# EasyEDA schematic SCH-mfd-menu-panel.json
TITLE: CJ4 MFD Menu panel; REV: 1.0; Date: 2021-06-11; Sheet: 1/1; Drawn By: Tuomas Kuosmanen; Company: Your Company
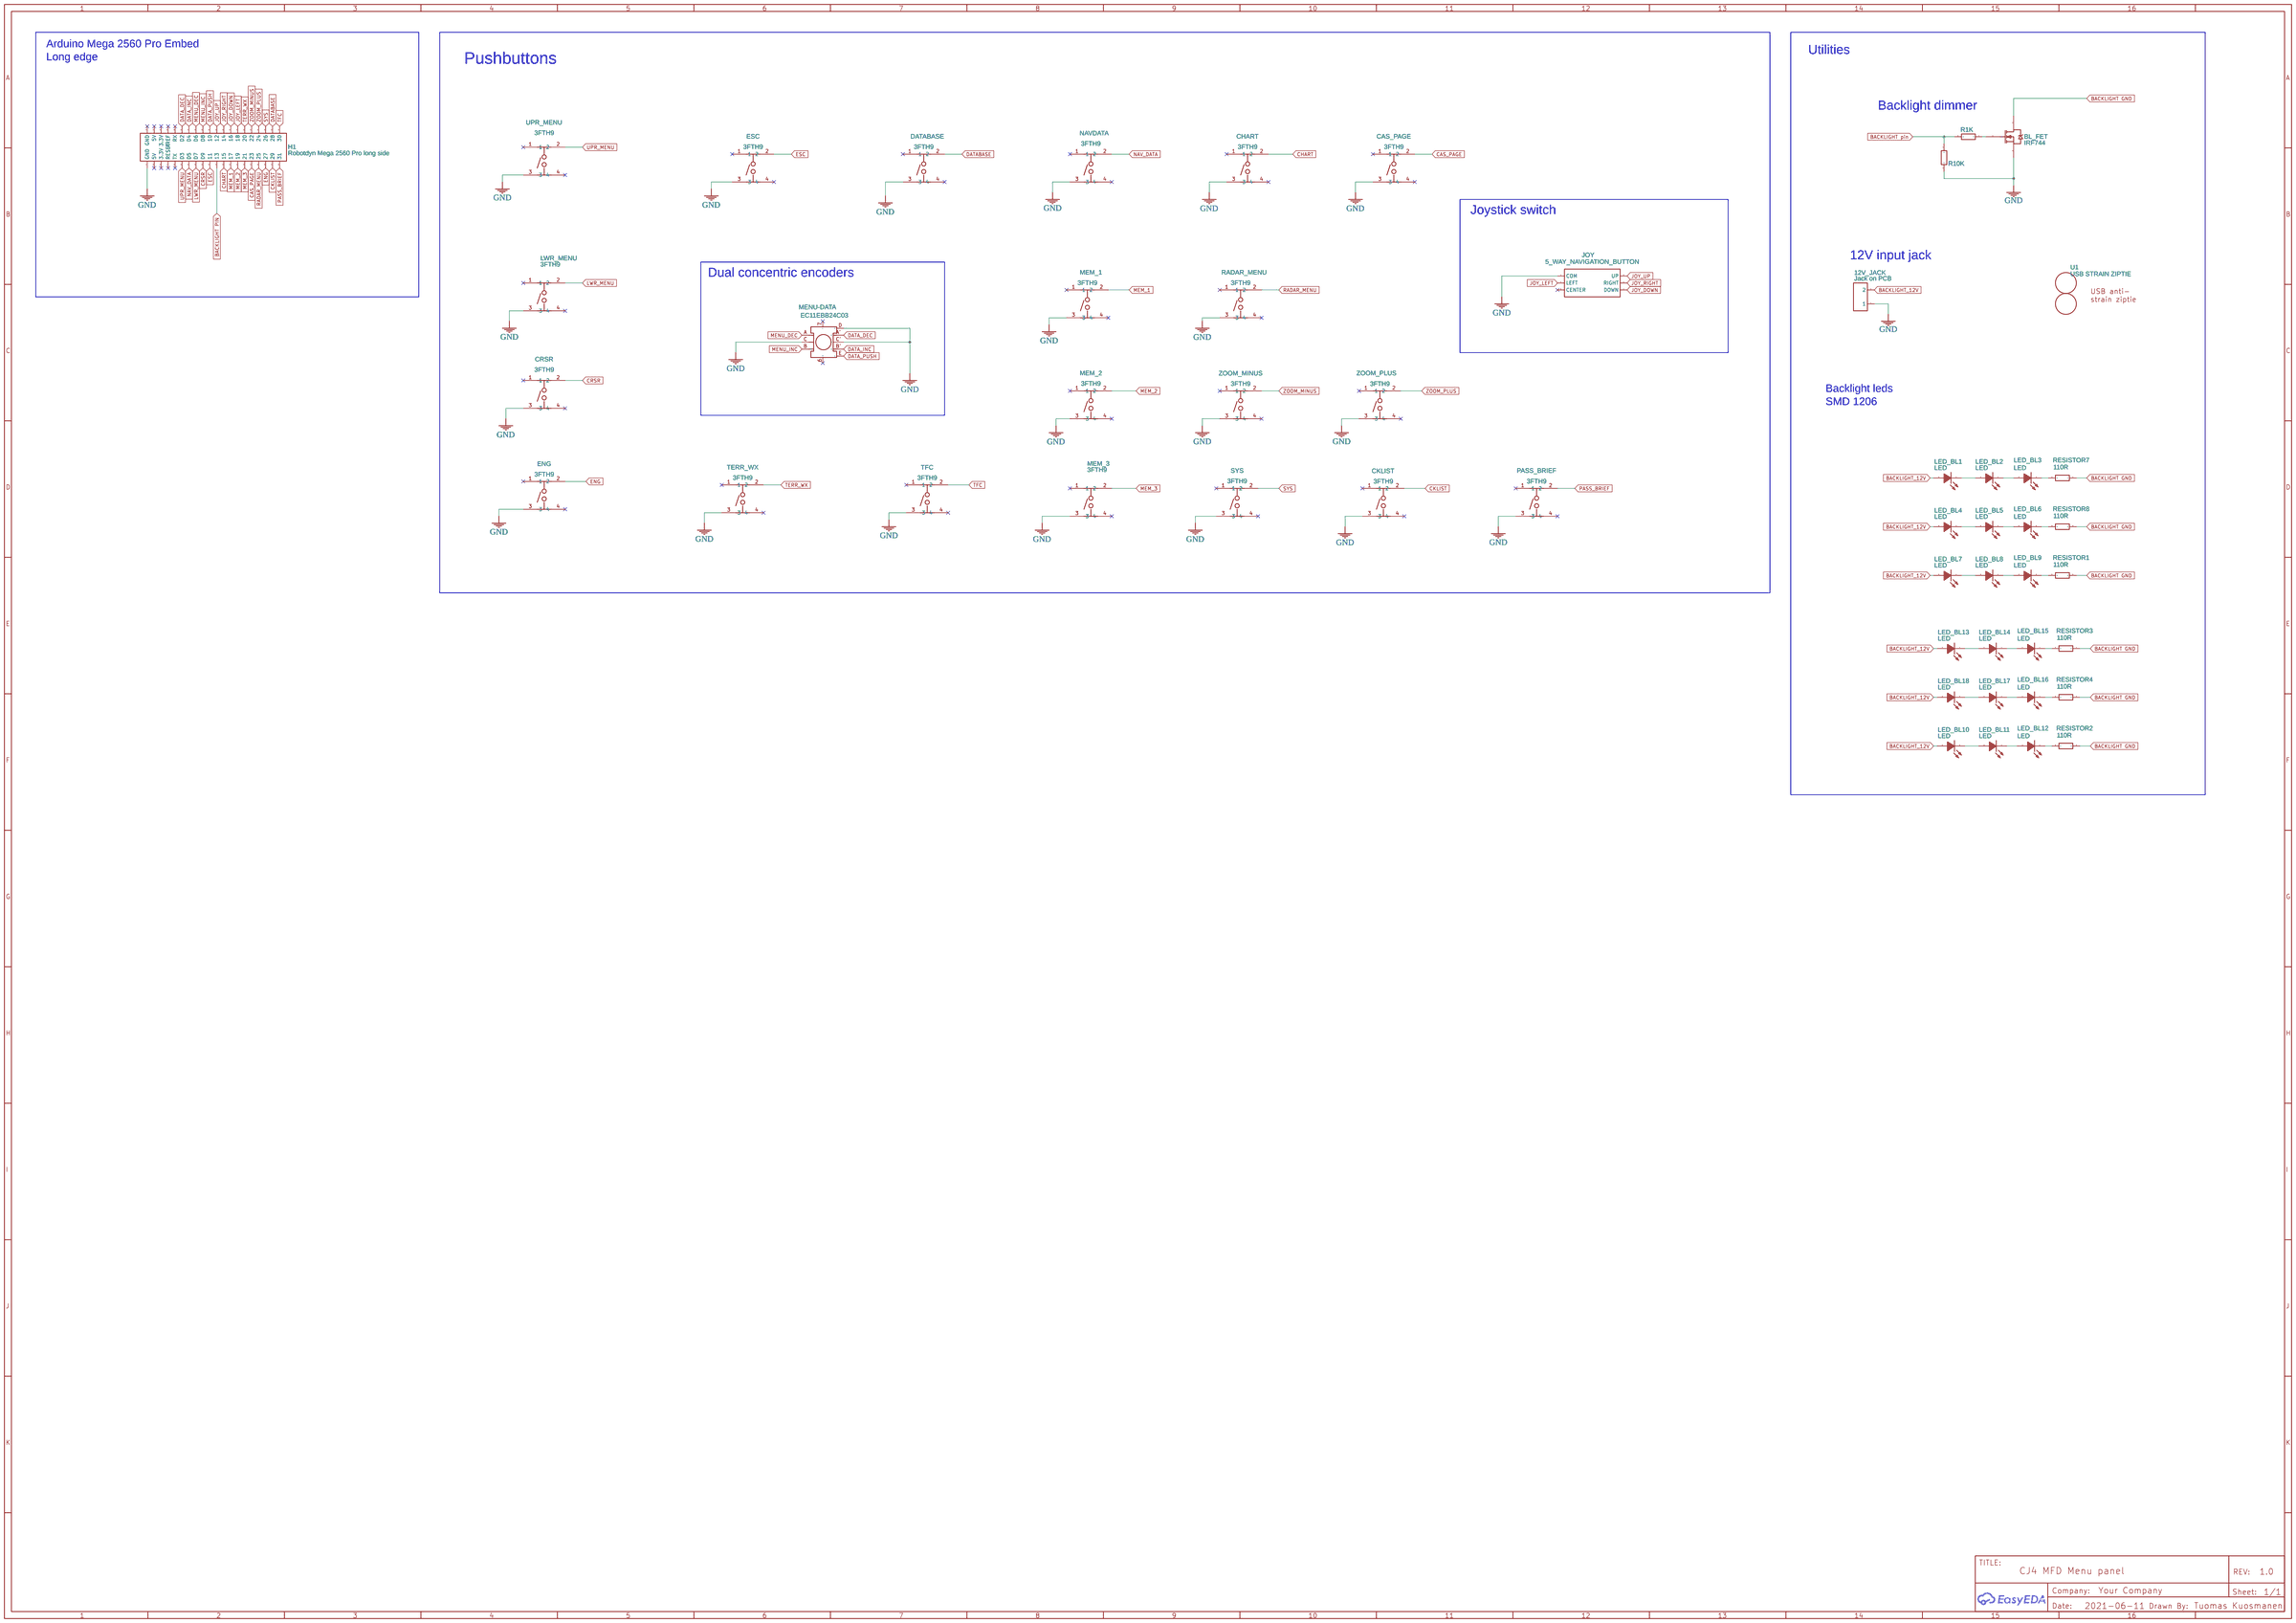
[diagram p0: schematic sheet]

## Parts
12V_JACK  Jack on PCB  [JACK ON PCB]
BL_FET  IRF744  [TO-220AB]
CAS_PAGE  3FTH9  [MULTIMEC 3FTH9 - NO LED]
CHART  3FTH9  [MULTIMEC 3FTH9 - NO LED]
CKLIST  3FTH9  [MULTIMEC 3FTH9 - NO LED]
CRSR  3FTH9  [MULTIMEC 3FTH9 - NO LED]
DATABASE  3FTH9  [MULTIMEC 3FTH9 - NO LED]
ENG  3FTH9  [MULTIMEC 3FTH9 - NO LED]
ESC  3FTH9  [MULTIMEC 3FTH9 - NO LED]
H1  Robotdyn Mega 2560 Pro long side  [HDR-TH_40P-P2.54-V-M-R2-C20-S2.54]
JOY  5_WAY_NAVIGATION_BUTTON  [5_WAY_NAVIGATION_BUTTON]
LED_BL1  LED  [LED1206-RD]
LED_BL2  LED  [LED1206-RD]
LED_BL3  LED  [LED1206-RD]
LED_BL4  LED  [LED1206-RD]
LED_BL5  LED  [LED1206-RD]
LED_BL6  LED  [LED1206-RD]
LED_BL7  LED  [LED1206-RD]
LED_BL8  LED  [LED1206-RD]
LED_BL9  LED  [LED1206-RD]
LED_BL10  LED  [LED1206-RD]
LED_BL11  LED  [LED1206-RD]
LED_BL12  LED  [LED1206-RD]
LED_BL13  LED  [LED1206-RD]
LED_BL14  LED  [LED1206-RD]
LED_BL15  LED  [LED1206-RD]
LED_BL16  LED  [LED1206-RD]
LED_BL17  LED  [LED1206-RD]
LED_BL18  LED  [LED1206-RD]
LWR_MENU  3FTH9  [MULTIMEC 3FTH9 - NO LED]
MEM_1  3FTH9  [MULTIMEC 3FTH9 - NO LED]
MEM_2  3FTH9  [MULTIMEC 3FTH9 - NO LED]
MEM_3  3FTH9  [MULTIMEC 3FTH9 - NO LED]
MENU-DATA  EC11EBB24C03  [SW-TH_EC11EBB24C03]
NAVDATA  3FTH9  [MULTIMEC 3FTH9 - NO LED]
PASS_BRIEF  3FTH9  [MULTIMEC 3FTH9 - NO LED]
PROTECT_BL1  R1K  [R1206]
R_ANN5  R10K  [R1206]
RADAR_MENU  3FTH9  [MULTIMEC 3FTH9 - NO LED]
RESISTOR1  110R  [R1206]
RESISTOR2  110R  [R1206]
RESISTOR3  110R  [R1206]
RESISTOR4  110R  [R1206]
RESISTOR7  110R  [R1206]
RESISTOR8  110R  [R1206]
SYS  3FTH9  [MULTIMEC 3FTH9 - NO LED]
TERR_WX  3FTH9  [MULTIMEC 3FTH9 - NO LED]
TFC  3FTH9  [MULTIMEC 3FTH9 - NO LED]
U1  USB STRAIN ZIPTIE  [USB STRAIN ZIPTIE]
UPR_MENU  3FTH9  [MULTIMEC 3FTH9 - NO LED]
ZOOM_MINUS  3FTH9  [MULTIMEC 3FTH9 - NO LED]
ZOOM_PLUS  3FTH9  [MULTIMEC 3FTH9 - NO LED]

## Library data of the parts
12V_JACK = J-Header-Male-2.54_1x2: Manufacturer: TE Connectivity; image: //image.lceda.cn/szlcsc/C86471.jpg; link: //image.lceda.cn/szlcsc/C86471.jpg; Package Display: No
BL_FET = IRF744: HEXFET N-Channel Power MOSFET
CAS_PAGE CHART CKLIST CRSR DATABASE ENG ESC LWR_MENU MEM_1-MEM_3 NAVDATA PASS_BRIEF RADAR_MENU SYS TERR_WX TFC UPR_MENU ZOOM_MINUS ZOOM_PLUS = 3FTH9: Manufacturer: MEC Switches; Supplier: Digi-Key; Supplier Part: 679-3730-5-ND; link: https://www.digikey.dk/product-detail/da/mec-switches/3FTH9/679-3730-5-ND/4376513; Contributor: Goose83
H1 = Header-Male-2.54_2x20: Supplier: LCSC; Manufacturer: ReliaPro; Supplier Part: C50980; JLCPCB Part Class: Extended Part
JOY = 5_WAY_NAVIGATION_BUTTON: Manufacturer Part: New SchematicLib; Contributor: lukasztolak
LED_BL1-LED_BL18 = HQ17-2102UYOC: Supplier: LCSC; Manufacturer: HARVATEK; Contributor: LCSC; Supplier Part: C154481; JLCPCB Part Class: Extended Part
MENU-DATA = EC11EBB24C03: Supplier: LCSC; Supplier Part: C470790; Manufacturer: ALPS Electric; Contributor: LCSC
PROTECT_BL1 R_ANN5 RESISTOR1-RESISTOR4 RESISTOR7 RESISTOR8 = 1206W4J0331T5E: Supplier: LCSC; Manufacturer: UniOhm; Supplier Part: C25374
U1 = USB STRAIN ZIPTIE: Contributor: tuomas.kuosmanen

## Nets
GND: 12V_JACK.1 BL_FET.3(S) CAS_PAGE.3 CHART.3 CKLIST.3 CRSR.3 DATABASE.3 ENG.3 ESC.3 H1.1(GND) JOY.1(COM) LWR_MENU.3 MEM_1.3 MEM_2.3 MEM_3.3 MENU-DATA.C MENU-DATA.C' MENU-DATA.D NAVDATA.3 PASS_BRIEF.3 R_ANN5.2 RADAR_MENU.3 SYS.3 TERR_WX.3 TFC.3 UPR_MENU.3 ZOOM_MINUS.3 ZOOM_PLUS.3
BACKLIGHT GND: BL_FET.2(D) RESISTOR1.1 RESISTOR2.1 RESISTOR3.1 RESISTOR4.1 RESISTOR7.1 RESISTOR8.1
BACKLIGHT PIN: H1.21(13)
BACKLIGHT pin: PROTECT_BL1.2 R_ANN5.1
BACKLIGHT_12V: 12V_JACK.2 LED_BL1.2(A) LED_BL4.2(A) LED_BL7.2(A) LED_BL10.2(A) LED_BL13.2(A) LED_BL18.2(A)
CAS_PAGE: CAS_PAGE.2 H1.31(23)
CHART: CHART.2 H1.23(15)
CKLIST: CKLIST.2 H1.37(29)
CRSR: CRSR.2 H1.17(D9)
DATA_DEC: H1.12(D2) MENU-DATA.A'
DATA_INC: H1.14(D4) MENU-DATA.B'
DATA_PUSH: H1.20(10) MENU-DATA.E
DATABASE: DATABASE.2 H1.38(28)
ENG: ENG.2 H1.35(27)
ESC: ESC.2 H1.19(11)
JOY_DOWN: H1.26(16) JOY.4(DOWN)
JOY_LEFT: H1.28(18) JOY.2(LEFT)
JOY_RIGHT: H1.24(14) JOY.5(RIGHT)
JOY_UP: H1.22(12) JOY.6(UP)
LWR_MENU: H1.15(D7) LWR_MENU.2
MEM_1: H1.25(17) MEM_1.2
MEM_2: H1.27(19) MEM_2.2
MEM_3: H1.29(21) MEM_3.2
MENU_DEC: H1.16(D6) MENU-DATA.A
MENU_INC: H1.18(D8) MENU-DATA.B
NAV_DATA: H1.13(D5) NAVDATA.2
PASS_BRIEF: H1.39(31) PASS_BRIEF.2
RADAR_MENU: H1.33(25) RADAR_MENU.2
SYS: H1.36(26) SYS.2
TERR_WX: H1.30(20) TERR_WX.2
TFC: H1.40(30) TFC.2
UPR_MENU: H1.11(D3) UPR_MENU.2
ZOOM_MINUS: H1.32(22) ZOOM_MINUS.2
ZOOM_PLUS: H1.34(24) ZOOM_PLUS.2
Net-(BL_FET-1): BL_FET.1(G) PROTECT_BL1.1
Net-(LED_BL1-1): LED_BL1.1(K) LED_BL2.2(A)
Net-(LED_BL2-1): LED_BL2.1(K) LED_BL3.2(A)
Net-(LED_BL3-1): LED_BL3.1(K) RESISTOR7.2
Net-(LED_BL4-1): LED_BL4.1(K) LED_BL5.2(A)
Net-(LED_BL5-1): LED_BL5.1(K) LED_BL6.2(A)
Net-(LED_BL6-1): LED_BL6.1(K) RESISTOR8.2
Net-(LED_BL7-1): LED_BL7.1(K) LED_BL8.2(A)
Net-(LED_BL8-1): LED_BL8.1(K) LED_BL9.2(A)
Net-(LED_BL9-1): LED_BL9.1(K) RESISTOR1.2
Net-(LED_BL10-1): LED_BL10.1(K) LED_BL11.2(A)
Net-(LED_BL11-1): LED_BL11.1(K) LED_BL12.2(A)
Net-(LED_BL12-1): LED_BL12.1(K) RESISTOR2.2
Net-(LED_BL13-1): LED_BL13.1(K) LED_BL14.2(A)
Net-(LED_BL14-1): LED_BL14.1(K) LED_BL15.2(A)
Net-(LED_BL15-1): LED_BL15.1(K) RESISTOR3.2
Net-(LED_BL16-1): LED_BL16.1(K) RESISTOR4.2
Net-(LED_BL16-2): LED_BL16.2(A) LED_BL17.1(K)
Net-(LED_BL17-2): LED_BL17.2(A) LED_BL18.1(K)

Not connected (* = marked no-connect by the designer): CAS_PAGE 1* 4*; CHART 1* 4*; CKLIST 1* 4*; CRSR 1* 4*; DATABASE 1* 4*; ENG 1* 4*; ESC 1* 4*; H1 2(GND)* 3(5V)* 4(5V)* 5(3.3V)* 6(3.3V)* 7(RESET)* 8(AREF)* 9(TX)* 10(RX)*; JOY 3(CENTER)*; LWR_MENU 1* 4*; MEM_1 1* 4*; MEM_2 1* 4*; MEM_3 1* 4*; MENU-DATA 6* 7*; NAVDATA 1* 4*; PASS_BRIEF 1* 4*; RADAR_MENU 1* 4*; SYS 1* 4*; TERR_WX 1* 4*; TFC 1* 4*; UPR_MENU 1* 4*; ZOOM_MINUS 1* 4*; ZOOM_PLUS 1* 4*

## Notes on the sheet
- Arduino Mega 2560 Pro Embed
  Long edge
- Utilities
- Pushbuttons
- Backlight dimmer
- Joystick switch
- 12V input jack
- Dual concentric encoders
- Backlight leds
  SMD 1206
